# EAGLE schematic SCCB1508-00 (EAGLE 7.3.0)

## Sheet 1 of 2
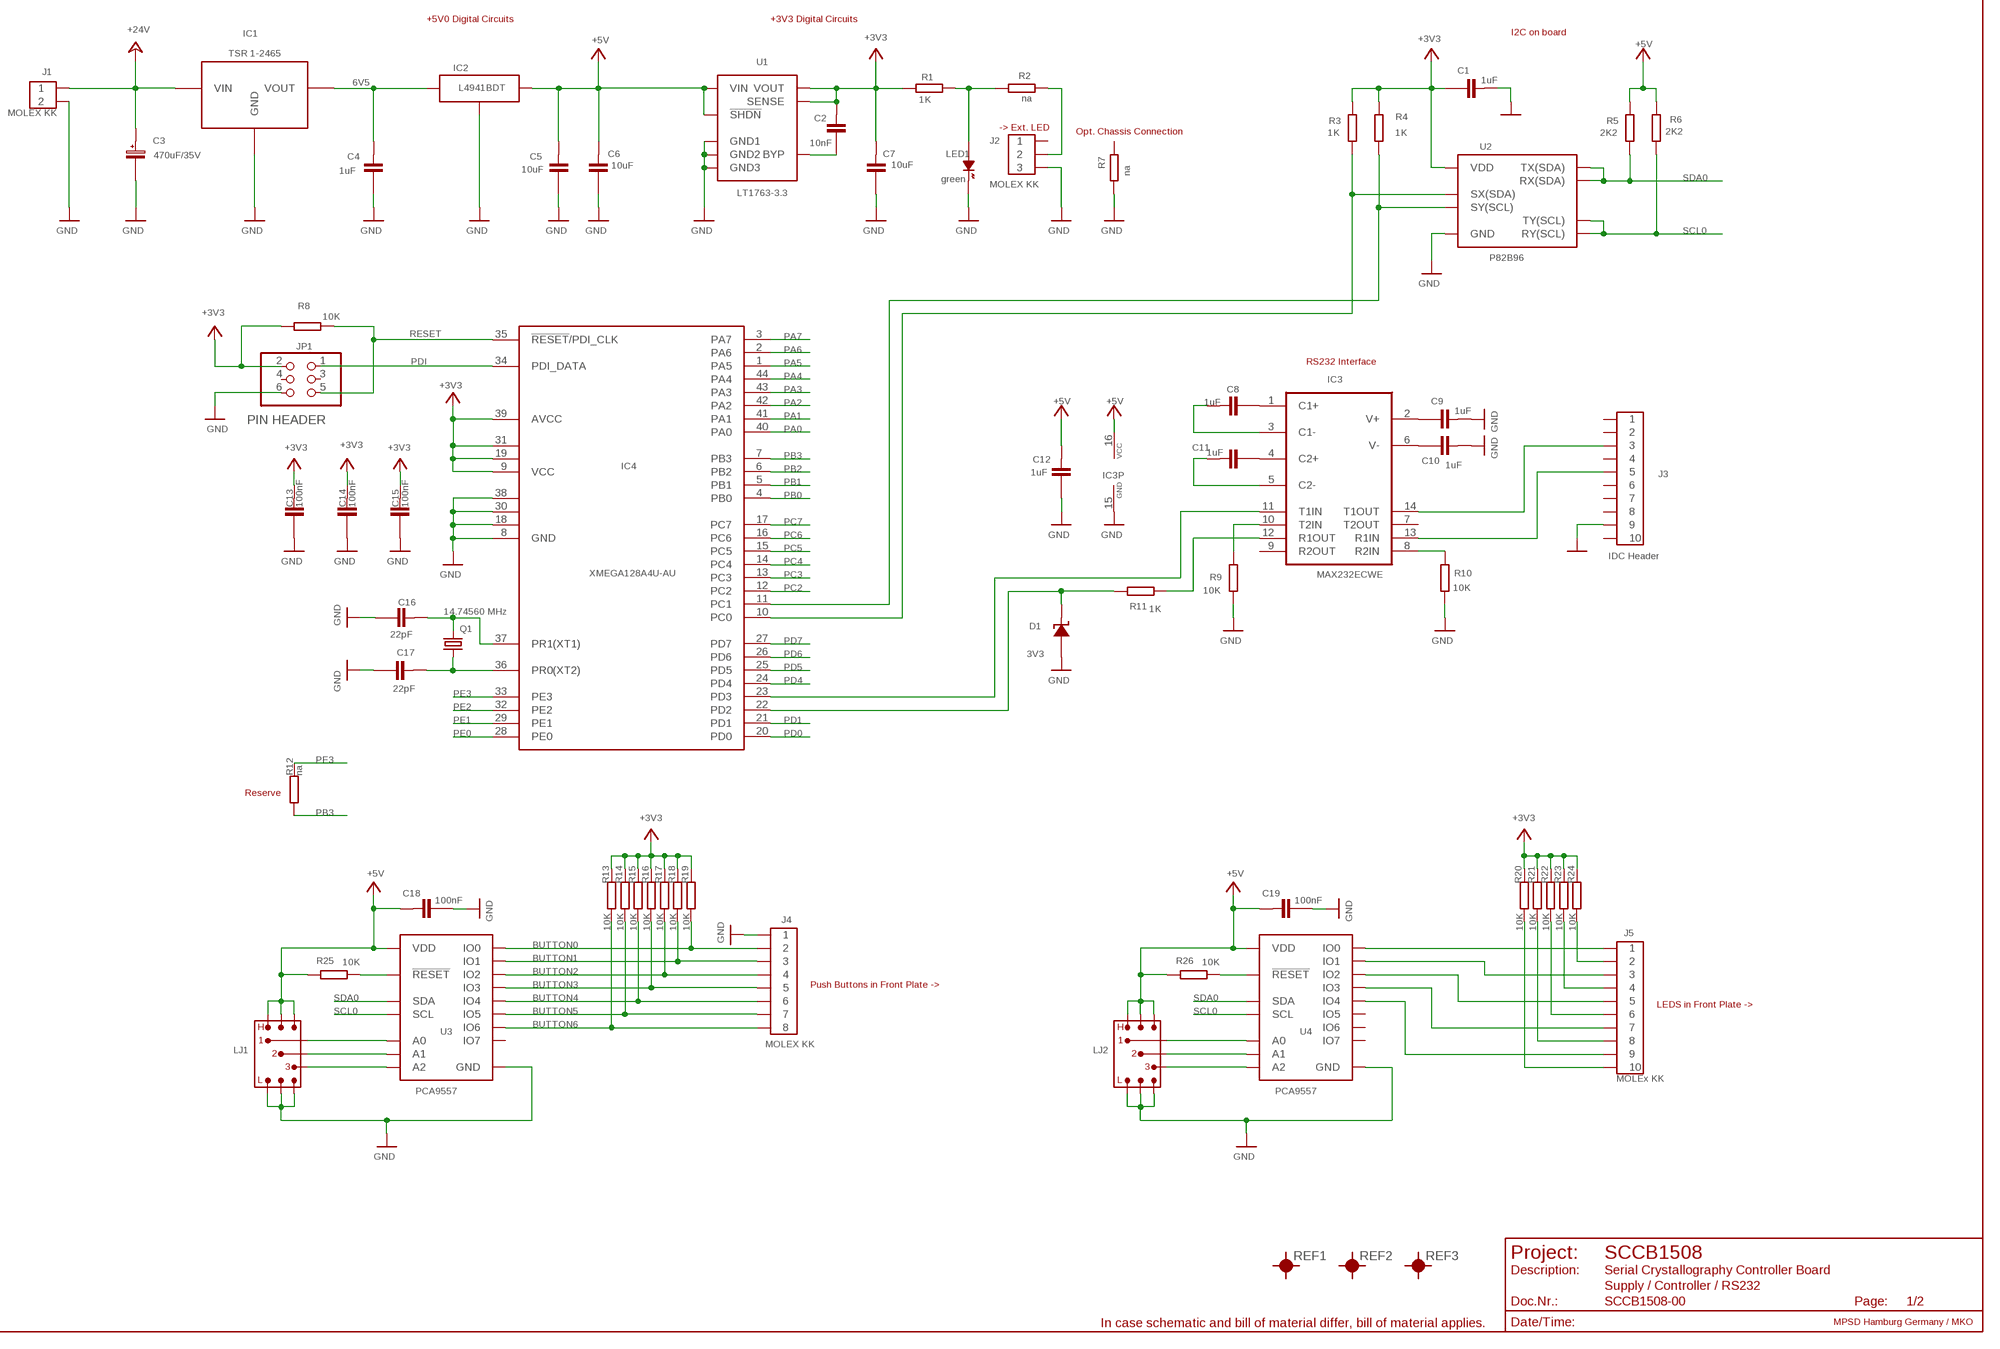
[diagram p0: schematic, sheet 1]
U$4 (FRAME_A3H_ENGL): BESCHREIBUNG_DER_SEITE: Supply / Controller / RS232; PROJEKTBESCHREIBUNG: Serial Crystallography Controller Board; PROJEKTNAME: SCCB1508

### Parts
C1  1uF  C_0805  [0805]
C2  10nF  C_0603  [0603]
C3  470uF/35V  C_POL_RM5_D16  [C_POL_RM5_D16]
C4  1uF  C_0805  [0805]
C5  10uF  C_1206  [1206]
C6  10uF  C_1206  [1206]
C7  10uF  C_1206  [1206]
C8  1uF  C_0805  [0805]
C9  1uF  C_0805  [0805]
C10  1uF  C_0805  [0805]
C11  1uF  C_0805  [0805]
C12  1uF  C_0805  [0805]
C13  100nF  C_0603  [0603]
C14  100nF  C_0603  [0603]
C15  100nF  C_0603  [0603]
C16  22pF  C_0603  [0603]
C17  22pF  C_0603  [0603]
C18  100nF  C_0603  [0603]
C19  100nF  C_0603  [0603]
D1  3V3  D_ZENER_SOT23  [SOT_23]
IC1  TSR 1-2465  TRACO_TSR_1  [TRACO_TSR_1]
IC2  L4941BDT  VOLTREG_LIN_3POL_D-PAK  [D_PAK]
IC3  MAX232ECWE  [SO16L]
IC4  XMEGA128A4U-AU  XMEGA16A4A  [TQFP44]
J1  MOLEX KK  CON_02_MOLEX_KK  [MOLEX_KK_02POL]
J2  MOLEX KK  CON_03_MOLEX_KK  [MOLEX_KK_03POL]
J3  IDC Header  CON_10_IDC_10  [IDC_WANNE_10POL]
J4  MOLEX KK  CON_08_MOLEX_KK  [MOLEX_KK_08POL]
J5  MOLEx KK  CON_10_MOLEX-KK  [MOLEX_KK_10POL]
JP1  PIN HEADER  PINHD-2X3  [2X03]
LED1  green  D_LED_0603  [0603_POL]
LJ1  LOETJUMPER_3KHL_  [LOETJUMPER_3KHL]
LJ2  LOETJUMPER_3KHL_  [LOETJUMPER_3KHL]
Q1  14.74560 MHz  CRYSTALHC49UP  [HC49UP]
R1  1K  R_0603  [0603]
R2  na  R_1206  [1206]
R3  1K  R_0603  [0603]
R4  1K  R_0603  [0603]
R5  2K2  R_0603  [0603]
R6  2K2  R_0603  [0603]
R7  na  R_0603  [0603]
R8  10K  R_0603  [0603]
R9  10K  R_0603  [0603]
R10  10K  R_0603  [0603]
R11  1K  R_0603  [0603]
R12  na  R_0805  [0805]
R13  10K  R_0603  [0603]
R14  10K  R_0603  [0603]
R15  10K  R_0603  [0603]
R16  10K  R_0603  [0603]
R17  10K  R_0603  [0603]
R18  10K  R_0603  [0603]
R19  10K  R_0603  [0603]
R20  10K  R_0603  [0603]
R21  10K  R_0603  [0603]
R22  10K  R_0603  [0603]
R23  10K  R_0603  [0603]
R24  10K  R_0603  [0603]
R25  10K  R_0603  [0603]
R26  10K  R_0603  [0603]
REF1  PASSERMARKE_1.0  [PASSERMARKE_01]
REF2  PASSERMARKE_1.0  [PASSERMARKE_01]
REF3  PASSERMARKE_1.0  [PASSERMARKE_01]
U1  LT1763-3.3  LT1763_SO8_ZE  [SOIC127P-6-8POL]
U2  P82B96  P82B96_SO8  [SO_8_BW3.9MM]
U3  PCA9557  PCA9557_SO_16  [SO_16_BW3.9MM]
U4  PCA9557  PCA9557_SO_16  [SO_16_BW3.9MM]

### Nets
6V5 [SUPPLY]: C4.2 IC1.P$3(VOUT) IC2.1(IN)
+3V3 [SUPPLY]: C1.1 C2.2 C7.2 C13.2 C14.2 C15.2 IC4.9(VCC) IC4.19(VCC1) IC4.31(VCC2) IC4.39(AVCC) JP1.2 R1.2 R3.1 R4.1 R8.1 R13.1 R14.1 R15.1 R16.1 R17.1 R18.1 R19.1 R20.1 R21.1 R22.1 R23.1 R24.1 U1.1(VOUT) U1.2(SENSE) U2.8(VDD) ; also sheet 2
+5V [SUPPLY]: C5.2 C6.2 C12.2 C18.2 C19.2 IC2.3(OUT) IC3.16(VCC) LJ1.H1 LJ1.H2 LJ1.H3 LJ2.H1 LJ2.H2 LJ2.H3 R5.1 R6.1 R25.2 R26.2 U1.5(!SHDN) U1.8(VIN) U3.16(VDD) U4.16(VDD) ; also sheet 2
+24V [SUPPLY]: C3.1(PLUS) IC1.P$1(VIN) J1.P$1
BUTTON0: J4.P$2 R19.2 U3.6(IO0)
BUTTON1: J4.P$3 R18.2 U3.7(IO1)
BUTTON2: J4.P$4 R17.2 U3.9(IO2)
BUTTON3: J4.P$5 R16.2 U3.10(IO3)
BUTTON4: J4.P$6 R15.2 U3.11(IO4)
BUTTON5: J4.P$7 R14.2 U3.12(IO5)
BUTTON6: J4.P$8 R13.2 U3.13(IO6)
GND [SUPPLY]: C1.2 C3.2(MINUS) C4.1 C5.1 C6.1 C7.1 C9.2 C10.2 C12.1 C13.1 C14.1 C15.1 C16.1 C17.1 C18.1 C19.1 D1.1(ANODE) IC1.P$2(GND) IC2.2(GND) IC3.15(GND) IC4.8(GND) IC4.18(GND1) IC4.30(GND2) IC4.38(GND3) J1.P$2 J2.P$3 J3.9 J4.P$1 JP1.6 LED1.1(KATHODE) LJ1.L1 LJ1.L2 LJ1.L3 LJ2.L1 LJ2.L2 LJ2.L3 R7.2 R9.1 R10.1 U1.3(GND1) U1.6(GND2) U1.7(GND3) U2.4(GND) U3.8(GND) U4.8(GND) ; also sheet 2
N$1: C8.1 IC3.1(C1+)
N$2: IC3.14(T1OUT) J3.3
N$3: C9.1 IC3.2(V+)
N$4: IC3.10(T2IN) R9.2
N$5: C10.1 IC3.6(V-)
N$6: C11.1 IC3.4(C2+)
N$7: C8.2 IC3.3(C1-)
N$8: IC3.8(R2IN) R10.2
N$9: C11.2 IC3.5(C2-)
N$10: C2.1 U1.4(BYP)
N$11: LED1.2(ANODE) R1.1 R2.1
N$14: J2.P$2 R2.2
N$15: C16.2 IC4.37(PR1(XT1)) Q1.1
N$16: C17.2 IC4.36(PR0(XT2)) Q1.2
N$17: IC3.12(R1OUT) R11.2
N$18: J5.P$2 R24.2
N$19: J5.P$4 R23.2
N$20: J5.P$6 R22.2
N$21: J5.P$8 R21.2
N$24: IC3.13(R1IN) J3.5
N$28: J5.P$10 R20.2
N$38: R25.1 U3.15(!RESET)
N$39: LJ2.1 U4.3(A0)
N$46: LJ2.2 U4.4(A1)
N$49: LJ2.3 U4.5(A2)
N$50: R26.1 U4.15(!RESET)
N$54: LJ1.1 U3.3(A0)
N$55: LJ1.2 U3.4(A1)
N$56: LJ1.3 U3.5(A2)
N$60: IC4.11(PC1) R4.2 U2.7(SY(SCL))
N$61: IC4.10(PC0) R3.2 U2.1(SX(SDA))
N$77: J5.P$1 U4.6(IO0)
N$80: J5.P$3 U4.7(IO1)
N$97: J5.P$5 U4.9(IO2)
N$98: J5.P$7 U4.10(IO3)
N$99: J5.P$9 U4.11(IO4)
PA0: IC4.40(PA0) ; also sheet 2
PA1: IC4.41(PA1) ; also sheet 2
PA2: IC4.42(PA2) ; also sheet 2
PA3: IC4.43(PA3) ; also sheet 2
PA4: IC4.44(PA4) ; also sheet 2
PA5: IC4.1(PA5) ; also sheet 2
PA6: IC4.2(PA6) ; also sheet 2
PA7: IC4.3(PA7) ; also sheet 2
PB0: IC4.4(PB0) ; also sheet 2
PB1: IC4.5(PB1) ; also sheet 2
PB2: IC4.6(PB2) ; also sheet 2
PB3: IC4.7(PB3) R12.1
PC2: IC4.12(PC2) ; also sheet 2
PC3: IC4.13(PC3) ; also sheet 2
PC4: IC4.14(PC4) ; also sheet 2
PC5: IC4.15(PC5) ; also sheet 2
PC6: IC4.16(PC6) ; also sheet 2
PC7: IC4.17(PC7) ; also sheet 2
PD0: IC4.20(PD0) ; also sheet 2
PD1: IC4.21(PD1) ; also sheet 2
PD4: IC4.24(PD4) ; also sheet 2
PD5: IC4.25(PD5) ; also sheet 2
PD6: IC4.26(PD6) ; also sheet 2
PD7: IC4.27(PD7) ; also sheet 2
PDI: IC4.34(PDI_DATA) JP1.1
PE0: IC4.28(PE0) ; also sheet 2
PE1: IC4.29(PE1) ; also sheet 2
PE2: IC4.32(PE2) ; also sheet 2
PE3: IC4.33(PE3) R12.2
RESET: IC4.35(!RESET!/PDI_CLK) JP1.5 R8.2
RX0: D1.3(KATHODE) IC4.22(PD2) R11.1
SCL0: R6.2 U2.5(TY(SCL)) U2.6(RY(SCL)) U3.1(SCL) U4.1(SCL) ; also sheet 2
SDA0: R5.2 U2.2(RX(SDA)) U2.3(TX(SDA)) U3.2(SDA) U4.2(SDA) ; also sheet 2
TX0: IC3.11(T1IN) IC4.23(PD3)
Unconnected: IC3.7(T2OUT) IC3.9(R2OUT) J2.P$1 J3.1 J3.2 J3.4 J3.6 J3.7 J3.8 J3.10 JP1.3 JP1.4 R7.1 U3.14(IO7) U4.12(IO5) U4.13(IO6) U4.14(IO7)

### Notes on the sheet
- +5V0 Digital Circuits | +3V3 Digital Circuits
- I2C on board
- -> Ext. LED
- Opt. Chassis Connection
- RS232 Interface
- Reserve
- Push Buttons in Front Plate ->
- LEDS in Front Plate ->

## Sheet 2 of 2
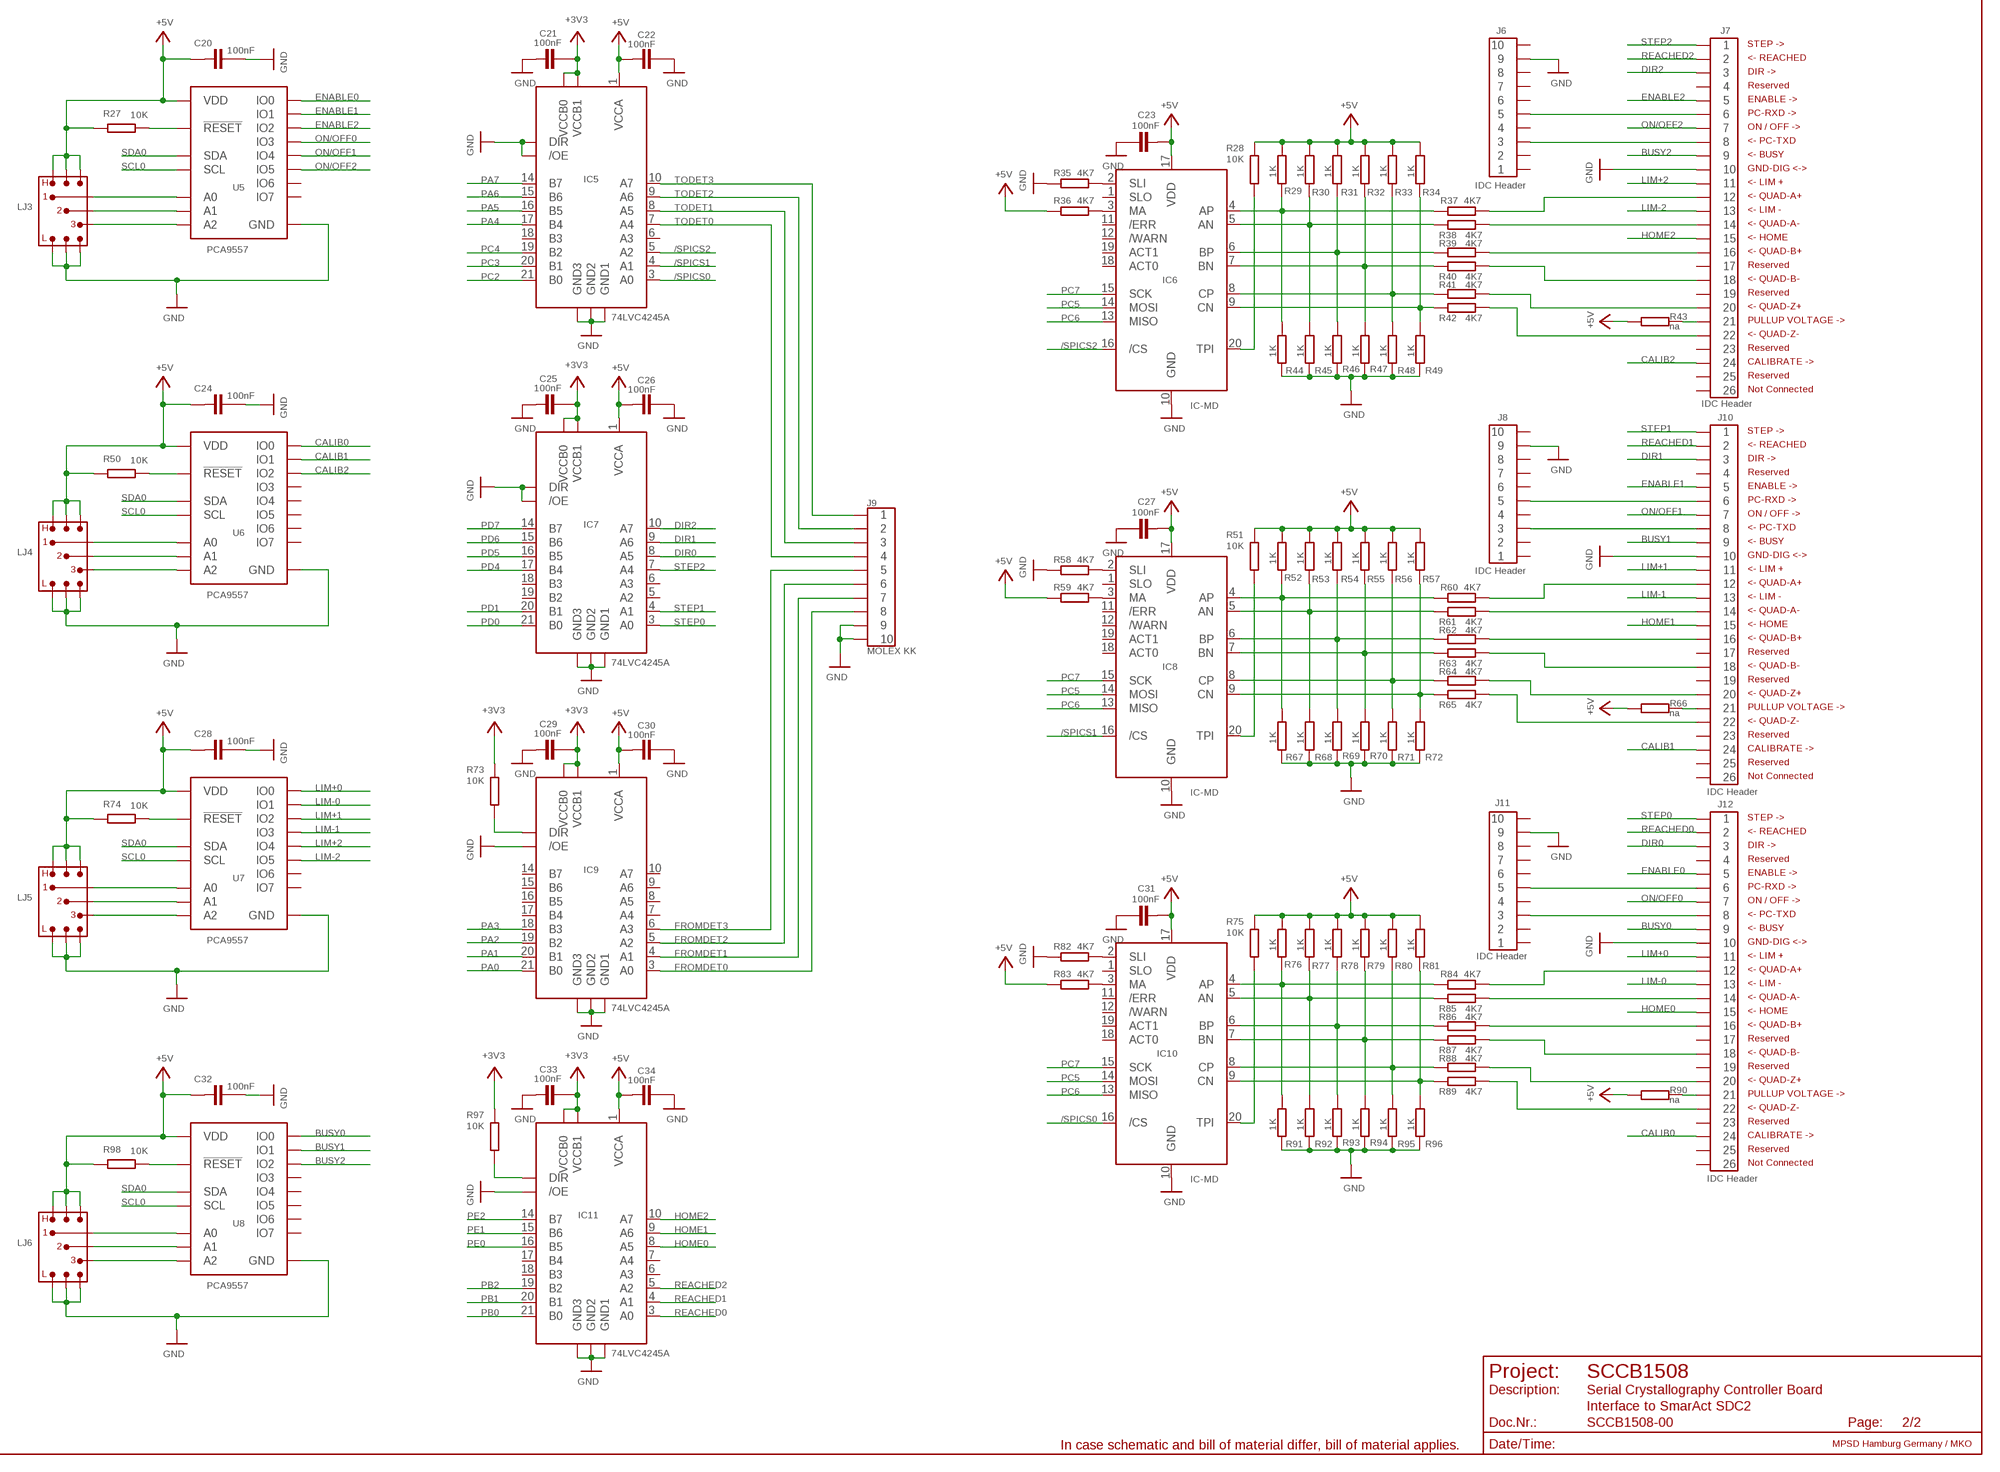
[diagram p1: schematic, sheet 2]
U$1 (FRAME_A3H_ENGL): BESCHREIBUNG_DER_SEITE: Interface to SmarAct SDC2; PROJEKTBESCHREIBUNG: Serial Crystallography Controller Board; PROJEKTNAME: SCCB1508

### Parts
C20  100nF  C_0603  [0603]
C21  100nF  C_0603  [0603]
C22  100nF  C_0603  [0603]
C23  100nF  C_0603  [0603]
C24  100nF  C_0603  [0603]
C25  100nF  C_0603  [0603]
C26  100nF  C_0603  [0603]
C27  100nF  C_0603  [0603]
C28  100nF  C_0603  [0603]
C29  100nF  C_0603  [0603]
C30  100nF  C_0603  [0603]
C31  100nF  C_0603  [0603]
C32  100nF  C_0603  [0603]
C33  100nF  C_0603  [0603]
C34  100nF  C_0603  [0603]
IC5  74LVC4245A  74LVC4245A_SSOP24  [SO_24_BW5.3MM]
IC6  IC-MD  IC-MD_SSOP-20  [SSOP_20_BW4.4]
IC7  74LVC4245A  74LVC4245A_SSOP24  [SO_24_BW5.3MM]
IC8  IC-MD  IC-MD_SSOP-20  [SSOP_20_BW4.4]
IC9  74LVC4245A  74LVC4245A_SSOP24  [SO_24_BW5.3MM]
IC10  IC-MD  IC-MD_SSOP-20  [SSOP_20_BW4.4]
IC11  74LVC4245A  74LVC4245A_SSOP24  [SO_24_BW5.3MM]
J6  IDC Header  CON_10_IDC_10  [IDC_WANNE_10POL]
J7  IDC Header  CON_26_IDC_HEADER  [IDC_WANNE_26POL]
J8  IDC Header  CON_10_IDC_10  [IDC_WANNE_10POL]
J9  MOLEX KK  CON_10_MOLEX-KK  [MOLEX_KK_10POL]
J10  IDC Header  CON_26_IDC_HEADER  [IDC_WANNE_26POL]
J11  IDC Header  CON_10_IDC_10  [IDC_WANNE_10POL]
J12  IDC Header  CON_26_IDC_HEADER  [IDC_WANNE_26POL]
LJ3  LOETJUMPER_3KHL_  [LOETJUMPER_3KHL]
LJ4  LOETJUMPER_3KHL_  [LOETJUMPER_3KHL]
LJ5  LOETJUMPER_3KHL_  [LOETJUMPER_3KHL]
LJ6  LOETJUMPER_3KHL_  [LOETJUMPER_3KHL]
R27  10K  R_0603  [0603]
R28  10K  R_0603  [0603]
R29  1K  R_0603  [0603]
R30  1K  R_0603  [0603]
R31  1K  R_0603  [0603]
R32  1K  R_0603  [0603]
R33  1K  R_0603  [0603]
R34  1K  R_0603  [0603]
R35  4K7  R_0603  [0603]
R36  4K7  R_0603  [0603]
R37  4K7  R_0603  [0603]
R38  4K7  R_0603  [0603]
R39  4K7  R_0603  [0603]
R40  4K7  R_0603  [0603]
R41  4K7  R_0603  [0603]
R42  4K7  R_0603  [0603]
R43  na  R_RM10B2.5  [RM10L10B2.5]
R44  1K  R_0603  [0603]
R45  1K  R_0603  [0603]
R46  1K  R_0603  [0603]
R47  1K  R_0603  [0603]
R48  1K  R_0603  [0603]
R49  1K  R_0603  [0603]
R50  10K  R_0603  [0603]
R51  10K  R_0603  [0603]
R52  1K  R_0603  [0603]
R53  1K  R_0603  [0603]
R54  1K  R_0603  [0603]
R55  1K  R_0603  [0603]
R56  1K  R_0603  [0603]
R57  1K  R_0603  [0603]
R58  4K7  R_0603  [0603]
R59  4K7  R_0603  [0603]
R60  4K7  R_0603  [0603]
R61  4K7  R_0603  [0603]
R62  4K7  R_0603  [0603]
R63  4K7  R_0603  [0603]
R64  4K7  R_0603  [0603]
R65  4K7  R_0603  [0603]
R66  na  R_RM10B2.5  [RM10L10B2.5]
R67  1K  R_0603  [0603]
R68  1K  R_0603  [0603]
R69  1K  R_0603  [0603]
R70  1K  R_0603  [0603]
R71  1K  R_0603  [0603]
R72  1K  R_0603  [0603]
R73  10K  R_0603  [0603]
R74  10K  R_0603  [0603]
R75  10K  R_0603  [0603]
R76  1K  R_0603  [0603]
R77  1K  R_0603  [0603]
R78  1K  R_0603  [0603]
R79  1K  R_0603  [0603]
R80  1K  R_0603  [0603]
R81  1K  R_0603  [0603]
R82  4K7  R_0603  [0603]
R83  4K7  R_0603  [0603]
R84  4K7  R_0603  [0603]
R85  4K7  R_0603  [0603]
R86  4K7  R_0603  [0603]
R87  4K7  R_0603  [0603]
R88  4K7  R_0603  [0603]
R89  4K7  R_0603  [0603]
R90  na  R_RM10B2.5  [RM10L10B2.5]
R91  1K  R_0603  [0603]
R92  1K  R_0603  [0603]
R93  1K  R_0603  [0603]
R94  1K  R_0603  [0603]
R95  1K  R_0603  [0603]
R96  1K  R_0603  [0603]
R97  10K  R_0603  [0603]
R98  10K  R_0603  [0603]
U5  PCA9557  PCA9557_SO_16  [SO_16_BW3.9MM]
U6  PCA9557  PCA9557_SO_16  [SO_16_BW3.9MM]
U7  PCA9557  PCA9557_SO_16  [SO_16_BW3.9MM]
U8  PCA9557  PCA9557_SO_16  [SO_16_BW3.9MM]

### Nets
+3V3 [SUPPLY]: C21.1 C25.1 C29.1 C33.1 IC5.23(VCCB0) IC5.24(VCCB1) IC7.23(VCCB0) IC7.24(VCCB1) IC9.23(VCCB0) IC9.24(VCCB1) IC11.23(VCCB0) IC11.24(VCCB1) R73.1 R97.1 ; also sheet 1
+5V [SUPPLY]: C20.2 C22.2 C23.2 C24.2 C26.2 C27.2 C28.2 C30.2 C31.2 C32.2 C34.2 IC5.1(VCCA) IC6.17(VDD) IC7.1(VCCA) IC8.17(VDD) IC9.1(VCCA) IC10.17(VDD) IC11.1(VCCA) LJ3.H1 LJ3.H2 LJ3.H3 LJ4.H1 LJ4.H2 LJ4.H3 LJ5.H1 LJ5.H2 LJ5.H3 LJ6.H1 LJ6.H2 LJ6.H3 R27.2 R28.1 R29.2 R30.2 R31.2 R32.2 R33.2 R34.2 R36.1 R43.1 R50.2 R51.1 R52.2 R53.2 R54.2 R55.2 R56.2 R57.2 R59.1 R66.1 R74.2 R75.1 R76.2 R77.2 R78.2 R79.2 R80.2 R81.2 R83.1 R90.1 R98.2 U5.16(VDD) U6.16(VDD) U7.16(VDD) U8.16(VDD) ; also sheet 1
/SPICS0: IC5.3(A0) IC10.16(/CS)
/SPICS1: IC5.4(A1) IC8.16(/CS)
/SPICS2: IC5.5(A2) IC6.16(/CS)
BUSY0: J12.9 U8.6(IO0)
BUSY1: J10.9 U8.7(IO1)
BUSY2: J7.9 U8.9(IO2)
CALIB0: J12.24 U6.6(IO0)
CALIB1: J10.24 U6.7(IO1)
CALIB2: J7.24 U6.9(IO2)
DIR0: IC7.8(A5) J12.3
DIR1: IC7.9(A6) J10.3
DIR2: IC7.10(A7) J7.3
ENABLE0: J12.5 U5.6(IO0)
ENABLE1: J10.5 U5.7(IO1)
ENABLE2: J7.5 U5.9(IO2)
FROMDET0: IC9.3(A0) J9.P$8
FROMDET1: IC9.4(A1) J9.P$7
FROMDET2: IC9.5(A2) J9.P$6
FROMDET3: IC9.6(A3) J9.P$5
GND [SUPPLY]: C20.1 C21.2 C22.1 C23.1 C24.1 C25.2 C26.1 C27.1 C28.1 C29.2 C30.1 C31.1 C32.1 C33.2 C34.1 IC5.2(DIR) IC5.11(GND1) IC5.12(GND2) IC5.13(GND3) IC5.22(/OE) IC6.10(GND) IC7.2(DIR) IC7.11(GND1) IC7.12(GND2) IC7.13(GND3) IC7.22(/OE) IC8.10(GND) IC9.11(GND1) IC9.12(GND2) IC9.13(GND3) IC9.22(/OE) IC10.10(GND) IC11.11(GND1) IC11.12(GND2) IC11.13(GND3) IC11.22(/OE) J6.9 J7.10 J8.9 J9.P$9 J9.P$10 J10.10 J11.9 J12.10 LJ3.L1 LJ3.L2 LJ3.L3 LJ4.L1 LJ4.L2 LJ4.L3 LJ5.L1 LJ5.L2 LJ5.L3 LJ6.L1 LJ6.L2 LJ6.L3 R35.1 R44.1 R45.1 R46.1 R47.1 R48.1 R49.1 R58.1 R67.1 R68.1 R69.1 R70.1 R71.1 R72.1 R82.1 R91.1 R92.1 R93.1 R94.1 R95.1 R96.1 U5.8(GND) U6.8(GND) U7.8(GND) U8.8(GND) ; also sheet 1
HOME0: IC11.8(A5) J12.15
HOME1: IC11.9(A6) J10.15
HOME2: IC11.10(A7) J7.15
LIM+0: J12.11 U7.6(IO0)
LIM+1: J10.11 U7.9(IO2)
LIM+2: J7.11 U7.11(IO4)
LIM-0: J12.13 U7.7(IO1)
LIM-1: J10.13 U7.10(IO3)
LIM-2: J7.13 U7.12(IO5)
N$12: J6.3 J7.8
N$13: J6.5 J7.6
N$22: IC6.20(TPI) R28.2
N$23: IC6.9(CN) R34.1 R42.1 R49.2
N$25: IC6.8(CP) R33.1 R41.1 R48.2
N$26: IC6.7(BN) R32.1 R40.1 R47.2
N$29: IC6.6(BP) R31.1 R39.1 R46.2
N$30: IC6.5(AN) R30.1 R38.1 R45.2
N$31: IC6.4(AP) R29.1 R37.1 R44.2
N$32: IC6.3(MA) R36.2
N$33: IC6.2(SLI) R35.2
N$36: J7.12 R37.2
N$40: J7.14 R38.2
N$41: J7.16 R39.2
N$43: J7.18 R40.2
N$44: J7.20 R41.2
N$45: J7.22 R42.2
N$47: IC9.2(DIR) R73.2
N$48: IC11.2(DIR) R97.2
N$51: LJ5.1 U7.3(A0)
N$52: LJ5.2 U7.4(A1)
N$53: J7.21 R43.2
N$57: LJ5.3 U7.5(A2)
N$58: R74.1 U7.15(!RESET)
N$59: LJ3.1 U5.3(A0)
N$62: LJ3.2 U5.4(A1)
N$63: LJ3.3 U5.5(A2)
N$64: R27.1 U5.15(!RESET)
N$65: LJ4.1 U6.3(A0)
N$66: LJ4.2 U6.4(A1)
N$67: LJ4.3 U6.5(A2)
N$68: R50.1 U6.15(!RESET)
N$69: LJ6.1 U8.3(A0)
N$70: LJ6.2 U8.4(A1)
N$71: LJ6.3 U8.5(A2)
N$72: R98.1 U8.15(!RESET)
N$74: J8.3 J10.8
N$78: J8.5 J10.6
N$79: IC8.9(CN) R57.1 R65.1 R72.2
N$81: IC8.8(CP) R56.1 R64.1 R71.2
N$82: IC8.7(BN) R55.1 R63.1 R70.2
N$83: IC8.6(BP) R54.1 R62.1 R69.2
N$84: IC8.5(AN) R53.1 R61.1 R68.2
N$85: IC8.4(AP) R52.1 R60.1 R67.2
N$86: IC8.20(TPI) R51.2
N$87: IC8.3(MA) R59.2
N$88: IC8.2(SLI) R58.2
N$89: J10.12 R60.2
N$90: J10.14 R61.2
N$91: J10.16 R62.2
N$92: J10.18 R63.2
N$93: J10.20 R64.2
N$94: J10.22 R65.2
N$96: J10.21 R66.2
N$107: J11.3 J12.8
N$108: J11.5 J12.6
N$109: IC10.9(CN) R81.1 R89.1 R96.2
N$110: IC10.8(CP) R80.1 R88.1 R95.2
N$111: IC10.7(BN) R79.1 R87.1 R94.2
N$112: IC10.6(BP) R78.1 R86.1 R93.2
N$113: IC10.5(AN) R77.1 R85.1 R92.2
N$114: IC10.4(AP) R76.1 R84.1 R91.2
N$115: IC10.20(TPI) R75.2
N$116: IC10.3(MA) R83.2
N$117: IC10.2(SLI) R82.2
N$118: J12.12 R84.2
N$119: J12.14 R85.2
N$120: J12.16 R86.2
N$121: J12.18 R87.2
N$122: J12.20 R88.2
N$123: J12.22 R89.2
N$125: J12.21 R90.2
ON/OFF0: J12.7 U5.10(IO3)
ON/OFF1: J10.7 U5.11(IO4)
ON/OFF2: J7.7 U5.12(IO5)
PA0: IC9.21(B0) ; also sheet 1
PA1: IC9.20(B1) ; also sheet 1
PA2: IC9.19(B2) ; also sheet 1
PA3: IC9.18(B3) ; also sheet 1
PA4: IC5.17(B4) ; also sheet 1
PA5: IC5.16(B5) ; also sheet 1
PA6: IC5.15(B6) ; also sheet 1
PA7: IC5.14(B7) ; also sheet 1
PB0: IC11.21(B0) ; also sheet 1
PB1: IC11.20(B1) ; also sheet 1
PB2: IC11.19(B2) ; also sheet 1
PC2: IC5.21(B0) ; also sheet 1
PC3: IC5.20(B1) ; also sheet 1
PC4: IC5.19(B2) ; also sheet 1
PC5: IC6.14(MOSI) IC8.14(MOSI) IC10.14(MOSI) ; also sheet 1
PC6: IC6.13(MISO) IC8.13(MISO) IC10.13(MISO) ; also sheet 1
PC7: IC6.15(SCK) IC8.15(SCK) IC10.15(SCK) ; also sheet 1
PD0: IC7.21(B0) ; also sheet 1
PD1: IC7.20(B1) ; also sheet 1
PD4: IC7.17(B4) ; also sheet 1
PD5: IC7.16(B5) ; also sheet 1
PD6: IC7.15(B6) ; also sheet 1
PD7: IC7.14(B7) ; also sheet 1
PE0: IC11.16(B5) ; also sheet 1
PE1: IC11.15(B6) ; also sheet 1
PE2: IC11.14(B7) ; also sheet 1
REACHED0: IC11.3(A0) J12.2
REACHED1: IC11.4(A1) J10.2
REACHED2: IC11.5(A2) J7.2
SCL0: U5.1(SCL) U6.1(SCL) U7.1(SCL) U8.1(SCL) ; also sheet 1
SDA0: U5.2(SDA) U6.2(SDA) U7.2(SDA) U8.2(SDA) ; also sheet 1
STEP0: IC7.3(A0) J12.1
STEP1: IC7.4(A1) J10.1
STEP2: IC7.7(A4) J7.1
TODET0: IC5.7(A4) J9.P$4
TODET1: IC5.8(A5) J9.P$3
TODET2: IC5.9(A6) J9.P$2
TODET3: IC5.10(A7) J9.P$1
Unconnected: IC5.6(A3) IC5.18(B3) IC6.1(SLO) IC6.11(/ERR) IC6.12(/WARN) IC6.18(ACT0) IC6.19(ACT1) IC7.5(A2) IC7.6(A3) IC7.18(B3) IC7.19(B2) IC8.1(SLO) IC8.11(/ERR) IC8.12(/WARN) IC8.18(ACT0) IC8.19(ACT1) IC9.7(A4) IC9.8(A5) IC9.9(A6) IC9.10(A7) IC9.14(B7) IC9.15(B6) IC9.16(B5) IC9.17(B4) IC10.1(SLO) IC10.11(/ERR) IC10.12(/WARN) IC10.18(ACT0) IC10.19(ACT1) IC11.6(A3) IC11.7(A4) IC11.17(B4) IC11.18(B3) J6.1 J6.2 J6.4 J6.6 J6.7 J6.8 J6.10 J7.4 J7.17 J7.19 J7.23 J7.25 J7.26 J8.1 J8.2 J8.4 J8.6 J8.7 J8.8 J8.10 J10.4 J10.17 J10.19 J10.23 J10.25 J10.26 J11.1 J11.2 J11.4 J11.6 J11.7 J11.8 J11.10 J12.4 J12.17 J12.19 J12.23 J12.25 J12.26 U5.13(IO6) U5.14(IO7) U6.10(IO3) U6.11(IO4) U6.12(IO5) U6.13(IO6) U6.14(IO7) U7.13(IO6) U7.14(IO7) U8.10(IO3) U8.11(IO4) U8.12(IO5) U8.13(IO6) U8.14(IO7)

### Notes on the sheet
- STEP ->
- <- REACHED
- DIR ->
- Reserved
- ENABLE ->
- PC-RXD ->
- ON / OFF ->
- <- PC-TXD
- <- BUSY
- GND-DIG <->
- <- LIM +
- <- QUAD-A+
- <- LIM -
- <- QUAD-A-
- <- HOME
- <- QUAD-B+
- Reserved
- <- QUAD-B-
- Reserved
- <- QUAD-Z+
- PULLUP VOLTAGE ->
- <- QUAD-Z-
- Reserved
- CALIBRATE ->
- Reserved
- Not Connected
- STEP ->
- <- REACHED
- DIR ->
- Reserved
- ENABLE ->
- PC-RXD ->
- ON / OFF ->
- <- PC-TXD
- <- BUSY
- GND-DIG <->
- <- LIM +
- <- QUAD-A+
- <- LIM -
- <- QUAD-A-
- <- HOME
- <- QUAD-B+
- Reserved
- <- QUAD-B-
- Reserved
- <- QUAD-Z+
- PULLUP VOLTAGE ->
- <- QUAD-Z-
- Reserved
- CALIBRATE ->
- Reserved
- Not Connected
- STEP ->
- <- REACHED
- DIR ->
- Reserved
- ENABLE ->
- PC-RXD ->
- ON / OFF ->
- <- PC-TXD
- <- BUSY
- GND-DIG <->
- <- LIM +
- <- QUAD-A+
- <- LIM -
- <- QUAD-A-
- <- HOME
- <- QUAD-B+
- Reserved
- <- QUAD-B-
- Reserved
- <- QUAD-Z+
- PULLUP VOLTAGE ->
- <- QUAD-Z-
- Reserved
- CALIBRATE ->
- Reserved
- Not Connected

## Library data of the parts
C1 C2 C4-C34 = mko_lib:C_
C3 = mko_lib:C_POL_
D1 = mko_lib:D_ZENER_
IC1 = PowerSupply:TRACO_TSR_1: DC/DC Wandler Bürklin 26 K 2070..2086
IC2 = mko_lib:VOLTREG_LIN_3POL_
IC3 = maxim:MAX232ECWE: RS232 TRANSCEIVER; MF: MAXIM; MPN: MAX232ECWE+; OC_FARNELL: 9724435; OC_NEWARK: 67K4440
IC4 = atmel:XMEGA16A4: MICROCONTROLLER Features High-performance, Low-power 8/16-bit AVR XMEGA Microcontroller Non-Volatile Program and Data Memories - 16 KB - 128 KB of In-System Self-Programmable Flash - 4 KB - 8 KB Boot Code Section with Independent Lock Bits - 1 KB - 2 KB EEPROM - 2 KB - 8 KB Internal SRAM Peripheral Features - Four-channel DMA Controller with support for external requests - Eight-channel Event System - Five 16-bit Timer/Counters Three Timer/Counters with 4 Output Compare or Input Capture channels Two Timer/Counters with 2 Output Compare or Input Capture channels High-Resolution Extensions on all Timer/Counters Advanced Waveform Extension on one Timer/Counter - Five USARTs IrDA Extension on one USART - Two Two-Wire Interfaces with dual address match (I2C and SMBus compatible) - Two SPIs (Serial Peripheral Interfaces) peripherals - AES and DES Crypto Engine - 16-bit Real Time Counter with Separate Oscillator - One Twelve-channel, 12-bit, 2 Msps Analog to Digital Converter - One Two-channel, 12-bit, 1 Msps Digital to Analog Converter - Two Analog Comparators with Window compare function - External Interrupts on all General Purpose I/O pins - Programmable Watchdog Timer with Separate On-chip Ultra Low Power Oscillator Special Microcontroller Features - Power-on Reset and Programmable Brown-out Detection - Internal and External Clock Options with PLL - Programmable Multi-level Interrupt Controller - Sleep Modes: Idle, Power-down, Standby, Power-save, Extended Standby - Advanced Programming, Test and Debugging Interfaces PDI (Program and Debug Interface) for programming, test and debugging I/O and Packages - 34 Programmable I/O Lines - 44 - lead TQFP - 44 - pad VQFN/QFN - 49 - ball VFBGA Operating Voltage - 1.6 - 3.6V Speed performance - 0 - 12 MHz @ 1.6 - 3.6V - 0 - 32 MHz @ 2.7 - 3.6V Drawn by Dipl.-Ing. (FH) Robert Siegler Created: 27.05.09; OC_FARNELL: unknown; OC_NEWARK: unknown
IC5 IC7 IC9 IC11 = mko_lib:74LVC4245A_
IC6 IC8 IC10 = mko_lib:IC-MD_
J1 = mko_lib:CON_02_
J2 = mko_lib:CON_03_
J3 J5 J6 J8 J9 J11 = mko_lib:CON_10_
J4 = mko_lib:CON_08_
J7 J10 J12 = mko_lib:CON_26_
JP1 = pinhead:PINHD-2X3: PIN HEADER
LED1 = mko_lib:D_LED_
LJ1-LJ6 = mko_lib:LOETJUMPER_3KHL_
Q1 = crystal:CRYSTAL: CRYSTAL; OC_FARNELL: unknown; OC_NEWARK: unknown
R1-R98 = mko_lib:R_
REF1-REF3 = mko_lib:PASSERMARKE_
U1 = 20100401_lib:LT1763_
U2 = mko_lib:P82B96_
U3-U8 = mko_lib:PCA9557_

## Net classes
1 SUPPLY: width 0.4 mm, drill 0.4 mm